# EAGLE design gewaechshaus (EAGLE 9.2.2)
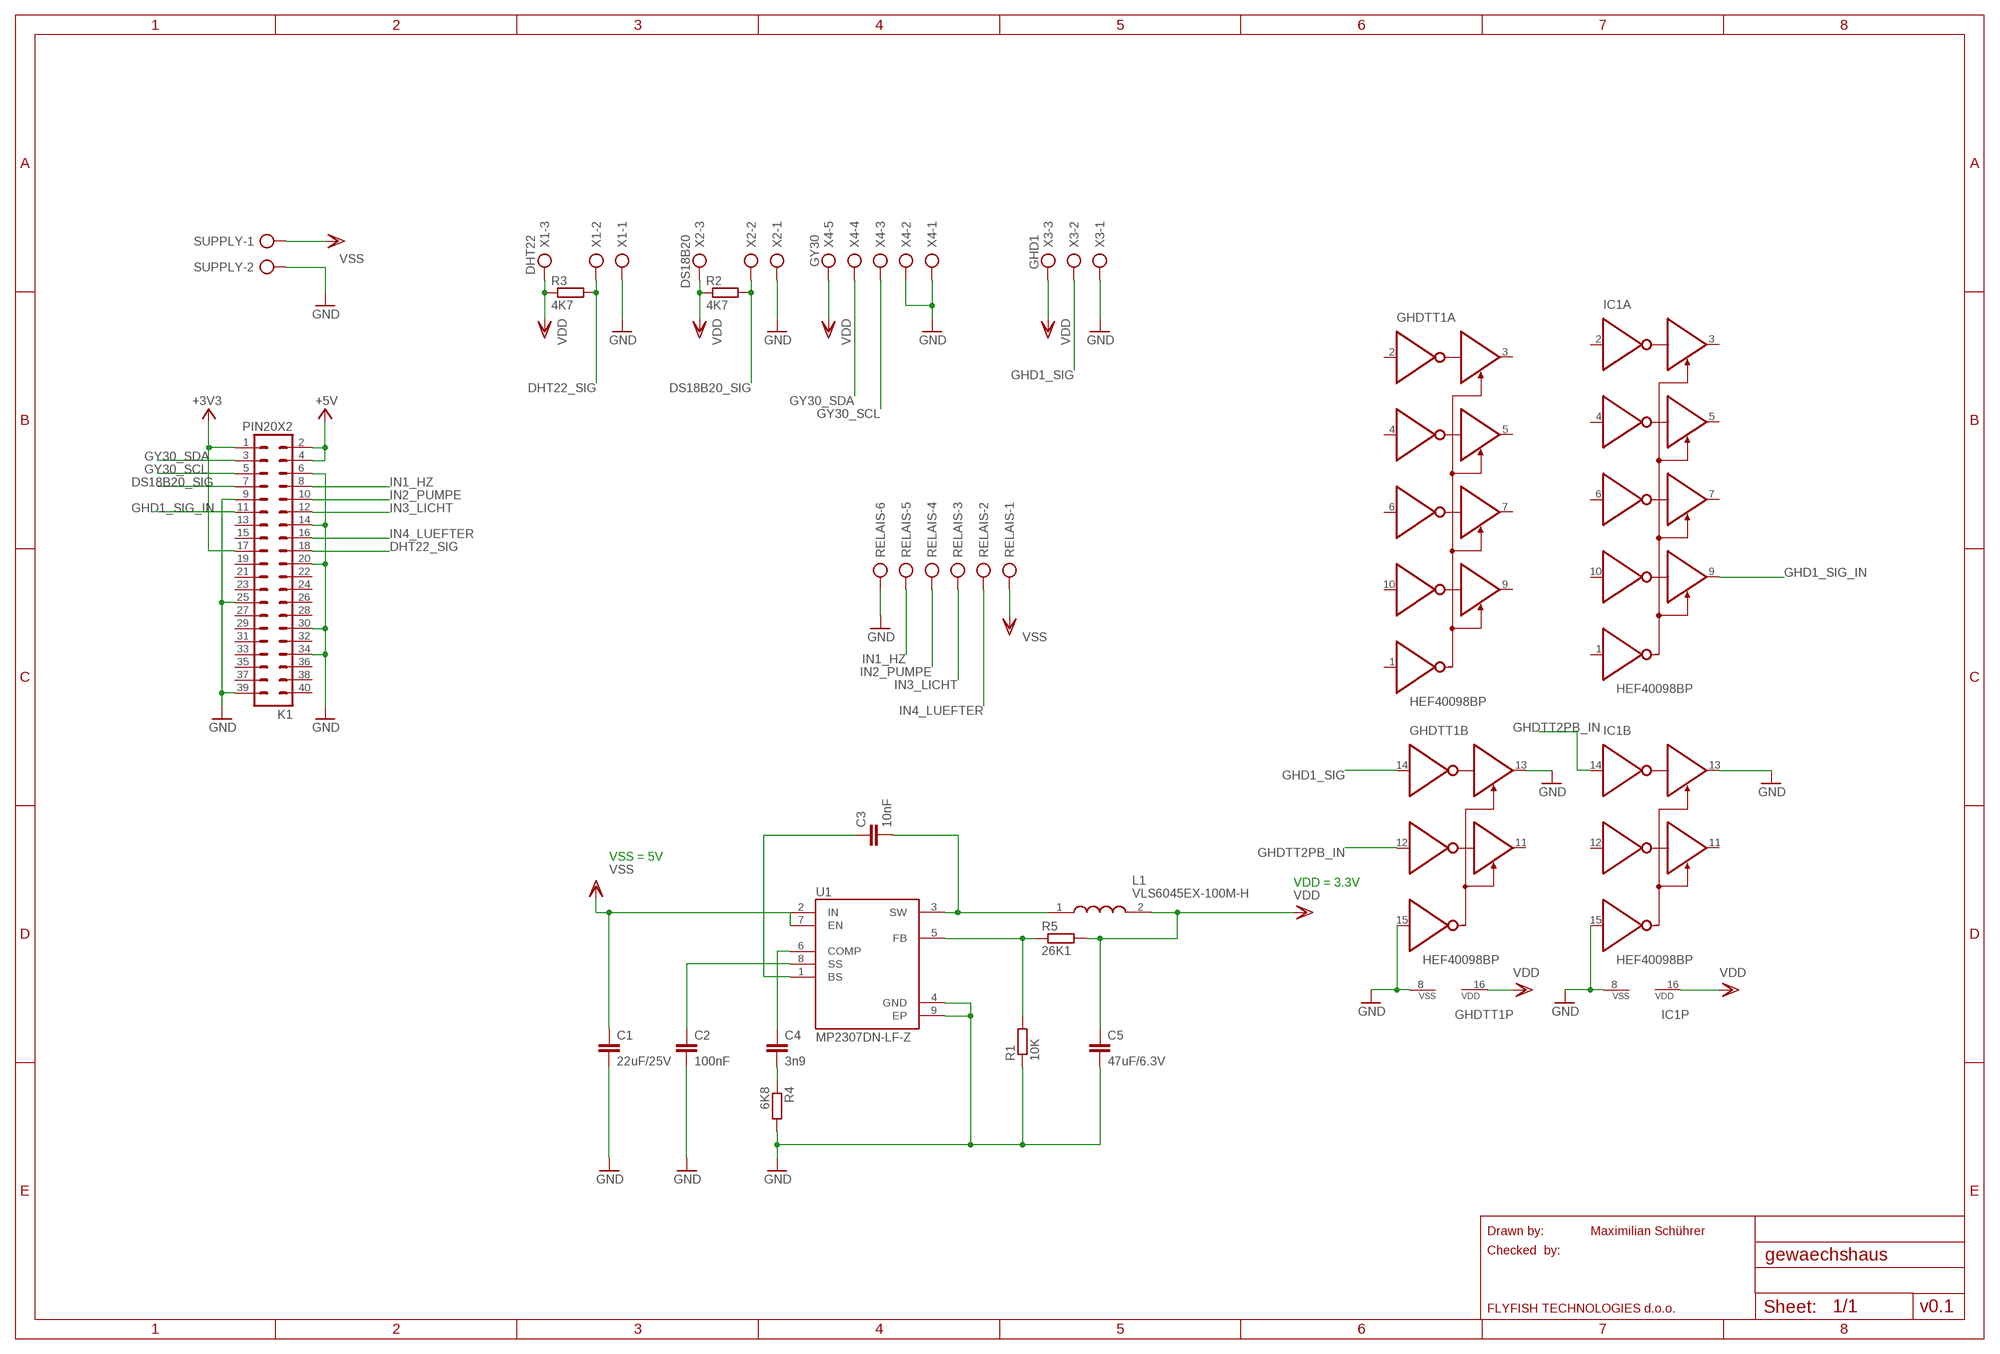
[diagram p0: schematic, sheet 1]

## Parts
C1  22uF/25V  C-EUC0805K  [C0805K]
C2  100nF  C-EUC0805K  [C0805K]
C3  10nF  C-EUC0805K  [C0805K]
C4  3n9  C-EUC0805K  [C0805K]
C5  47uF/6.3V  C-EUC0805K  [C0805K]
GHDTT1  HEF40098BP  [DIL16]
IC1  HEF40098BP  [DIL16]
K1  PIN20X2  [PIN_20X2]
L1  VLS6045EX-100M-H  [INDPM6360X450N]
R1  10K  R-EU_R0805  [R0805]
R2  4K7  R-EU_R0805  [R0805]
R3  4K7  R-EU_R0805  [R0805]
R4  6K8  R-EU_R0805  [R0805]
R5  26K1  R-EU_R0805  [R0805]
RELAIS  AK500/6  [AK500/6]
SUPPLY  AK500/2  [AK500/2]
U1  MP2307DN-LF-Z  [SOIC127P600X170-9N]
X1  DHT22  AK500/3  [AK500/3]
X2  DS18B20  AK500/3  [AK500/3]
X3  GHD1  AK500/3  [AK500/3]
X4  GY30  AK500/5  [AK500/5]

## Nets
+3V3: K1.1 K1.17
+5V: K1.2 K1.4
DHT22_SIG: K1.18 R3.2 X1.2
DS18B20_SIG: K1.7 R2.2 X2.2
GHD1_SIG: GHDTT1.14(B:2A0) X3.2
GHD1_SIG_IN: IC1.9(A:1Y3) K1.11
GHDTT2PB_IN: GHDTT1.12(B:2A1) IC1.14(B:2A0)
GND: C1.2 C2.2 C5.2 GHDTT1.8(P:VSS) GHDTT1.13(B:2Y0) GHDTT1.15(B:2!OE) IC1.8(P:VSS) IC1.13(B:2Y0) IC1.15(B:2!OE) K1.6 K1.9 K1.14 K1.20 K1.25 K1.30 K1.34 K1.39 R1.1 R4.2 RELAIS.6 SUPPLY.2 U1.4(GND) U1.9(EP) X1.1 X2.1 X3.1 X4.1 X4.2
GY30_SCL: K1.5 X4.3
GY30_SDA: K1.3 X4.4
IN1_HZ: K1.8 RELAIS.5
IN2_PUMPE: K1.10 RELAIS.4
IN3_LICHT: K1.12 RELAIS.3
IN4_LUEFTER: K1.16 RELAIS.2
N$1: R1.2 R5.1 U1.5(FB)
N$3: C2.1 U1.8(SS)
N$4: C3.1 U1.1(BS)
N$5: C3.2 L1.1 U1.3(SW)
N$6: C4.1 U1.6(COMP)
N$7: C4.2 R4.1
VDD: C5.1 GHDTT1.16(P:VDD) IC1.16(P:VDD) L1.2 R2.1 R3.1 R5.2 X1.3 X2.3 X3.3 X4.5
VSS: C1.1 RELAIS.1 SUPPLY.1 U1.2(IN) U1.7(EN)
Unconnected: GHDTT1.1(A:1!OE) GHDTT1.2(A:1A0) GHDTT1.3(A:1Y0) GHDTT1.4(A:1A1) GHDTT1.5(A:1Y1) GHDTT1.6(A:1A2) GHDTT1.7(A:1Y2) GHDTT1.9(A:1Y3) GHDTT1.10(A:1A3) GHDTT1.11(B:2Y1) IC1.1(A:1!OE) IC1.2(A:1A0) IC1.3(A:1Y0) IC1.4(A:1A1) IC1.5(A:1Y1) IC1.6(A:1A2) IC1.7(A:1Y2) IC1.10(A:1A3) IC1.11(B:2Y1) IC1.12(B:2A1) K1.13 K1.15 K1.19 K1.21 K1.22 K1.23 K1.24 K1.26 K1.27 K1.28 K1.29 K1.31 K1.32 K1.33 K1.35 K1.36 K1.37 K1.38 K1.40

## Notes on the sheet
- VSS = 5V
- VDD = 3.3V
- Drawn by: | Maximilian Schührer
- Checked  by:
- FLYFISH TECHNOLOGIES d.o.o. | v0.1

## Library data of the parts
C1-C5 = rcl:C-EU: CAPACITOR, European symbol; SPICEPREFIX: C
GHDTT1 IC1 = 40xx:HEF40098B: Hex inverting buffer, 3-state Source: Data sheet <http://www.nxp.com/documents/data_sheet/HEF40098B.pdf>
K1 = FLYFISH:PIN20X2
L1 = VLS6045EX-100M-H:VLS6045EX-100M-H: Inductors for Power Circuits, Automotive, Wound Ferrite material, VLS6045EX-H, -40 to +125 Source: Datasheet <https://componentsearchengine.com/Datasheets/1/VLS6045EX-100M-H.pdf>; DESCRIPTION: Inductors for Power Circuits, Automotive, Wound Ferrite material, VLS6045EX-H, -40 to +125; HEIGHT: 4.5mm; MANUFACTURER_NAME: TDK; MANUFACTURER_PART_NUMBER: VLS6045EX-100M-H; MOUSER_PART_NUMBER: 810-VLS6045EX-100M-H
R1-R5 = rcl:R-EU_: RESISTOR, European symbol; SPICEPREFIX: R
RELAIS = con-ptr500:AK500/6: CONNECTOR; OC_FARNELL: unknown; OC_NEWARK: unknown
SUPPLY = con-ptr500:AK500/2: CONNECTOR; OC_FARNELL: unknown; OC_NEWARK: unknown
U1 = MP2307DN-LF-Z:MP2307DN-LF-Z: MP2307 Series 23 V 3 A 380 KHz Synchronous Rectified Step-Down Converter-SOIC-8; AVAILABILITY: Unavailable; DESCRIPTION: MP2307 Series 23 V 3 A 380 KHz Synchronous Rectified Step-Down Converter-SOIC-8; MF: Monolithic Power; MP: MP2307DN-LF-Z; PACKAGE: SOIC-8 Monolithic Power; PRICE: None
X1-X3 = con-ptr500:AK500/3: CONNECTOR; OC_FARNELL: unknown; OC_NEWARK: unknown
X4 = con-ptr500:AK500/5: CONNECTOR; OC_FARNELL: unknown; OC_NEWARK: unknown

## Board
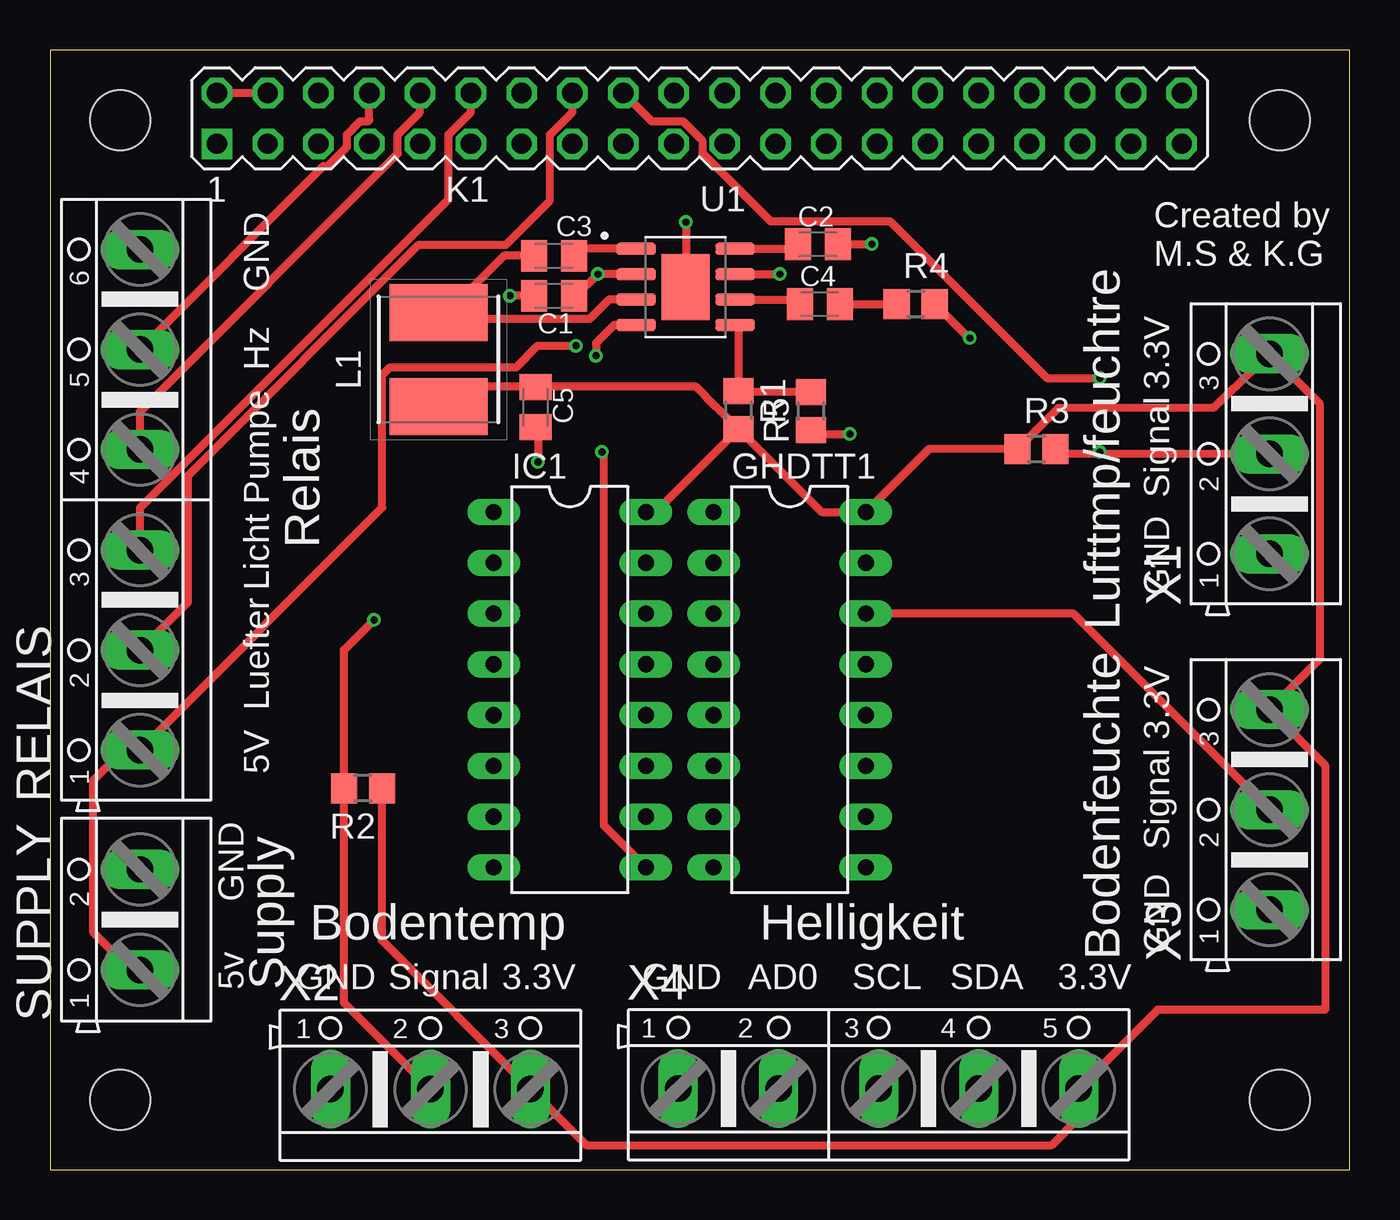
[diagram p1: board, top side]
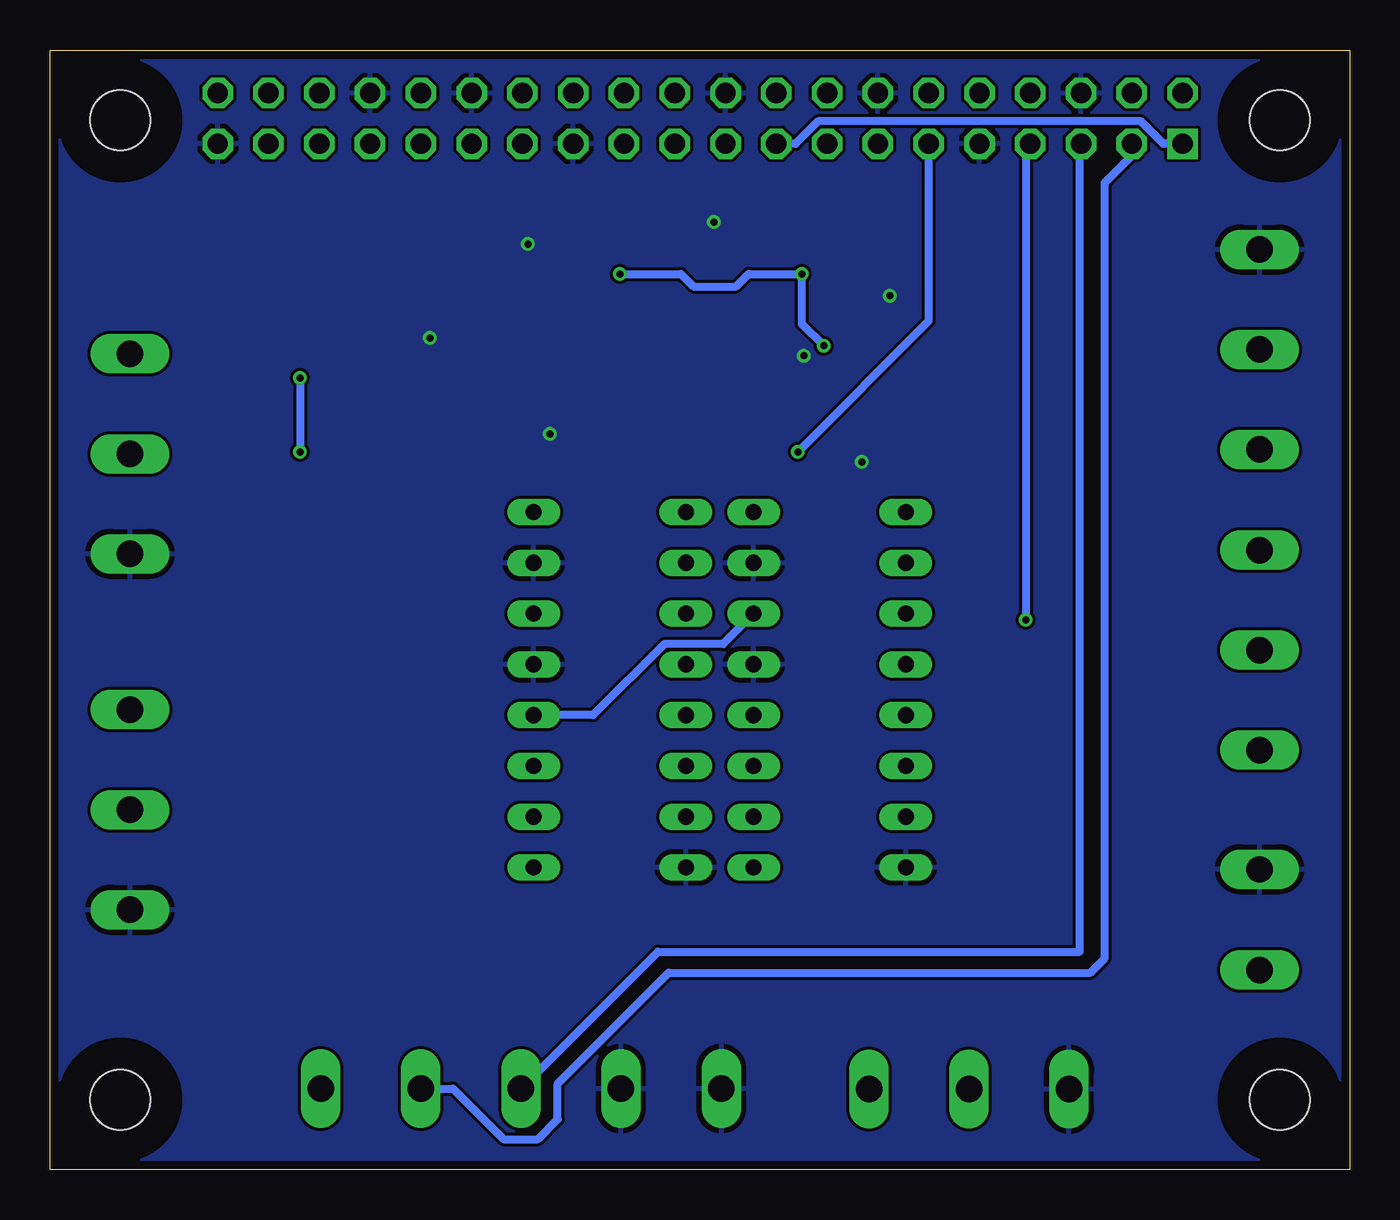
[diagram p2: board, bottom side, seen from below]

Size 65 x 56 mm. Coordinates in mm from the lower left corner, seen from the top.
Outline: 0,0 65,0 65,56 0,56 0,0
Copper layers (1*16): Top 0.035mm / dielectric 1.5mm / Bottom 0.035mm
Design rules "MyRules": minimum track width 6mil, minimum drill 12mil, track to track 6mil, track to pad 6mil, pad to pad 6mil, via to via 6mil, smd to smd 0mil, copper to edge 10mil, drill to drill 10mil, minimum pad ring 10mil, minimum via ring 6mil, stop-mask expansion 2mil, vias tented up to drill 25mil, thermal gap 10mil
Holes 3 mm at 3.5,52.5 61.5,52.5 61.5,3.5 3.5,3.5
tRestrict: area 1.9,51 to 5,54; area 60,51 to 63,54; area 60,1.9 to 63,5; area 1.9,1.9 to 5,5
bRestrict: area 1.9,51 to 5,54; area 60,51 to 63,54; area 60,1.9 to 63,5; area 1.9,1.9 to 5,5

### Footprints (pad centres in the part's own frame; a part is rotated, then mirrored left to right if it is on the bottom)
C0805K = smd 1.3 x 1.6: 1 -1,0; 2 1,0
DIL16 = drill 0.813 long: 1 -8.89,-3.81; 2 -6.35,-3.81; 3 -3.81,-3.81; 4 -1.27,-3.81; 5 1.27,-3.81; 6 3.81,-3.81; 7 6.35,-3.81; 8 8.89,-3.81; 9 8.89,3.81; 10 6.35,3.81; 11 3.81,3.81; 12 1.27,3.81; 13 -1.27,3.81; 14 -3.81,3.81; 15 -6.35,3.81; 16 -8.89,3.81
PIN_20X2 = drill 1.016 square: 1 -24.13,-1.27 | drill 1.016 octagon: 2 -24.13,1.27; 3 -21.59,-1.27; 4 -21.59,1.27; 5 -19.05,-1.27; 6 -19.05,1.27; 7 -16.51,-1.27; 8 -16.51,1.27; 9 -13.97,-1.27; 10 -13.97,1.27; 11 -11.43,-1.27; 12 -11.43,1.27; 13 -8.89,-1.27; 14 -8.89,1.27; 15 -6.35,-1.27; 16 -6.35,1.27; 17 -3.81,-1.27; 18 -3.81,1.27; 19 -1.27,-1.27; 20 -1.27,1.27; 21 1.27,-1.27; 22 1.27,1.27; 23 3.81,-1.27; 24 3.81,1.27; 25 6.35,-1.27; 26 6.35,1.27; 27 8.89,-1.27; 28 8.89,1.27; 29 11.43,-1.27; 30 11.43,1.27; 31 13.97,-1.27; 32 13.97,1.27; 33 16.51,-1.27; 34 16.51,1.27; 35 19.05,-1.27; 36 19.05,1.27; 37 21.59,-1.27; 38 21.59,1.27; 39 24.13,-1.27; 40 24.13,1.27
INDPM6360X450N = smd 2.85 x 4.9: 1 -2.35,0; 2 2.35,0
R0805 = smd 1.3 x 1.5: 1 -0.95,0; 2 0.95,0
AK500/6 = drill 1.321 long: 1 -12.522,0; 2 -7.518,0; 3 -2.515,0; 4 2.515,0; 5 7.518,0; 6 12.522,0
AK500/2 = drill 1.321 long: 1 -2.515,0; 2 2.515,0
SOIC127P600X170-9N = smd 1.97 x 0.6: 1 -2.475,1.905; 2 -2.475,0.635; 3 -2.475,-0.635; 4 -2.475,-1.905; 5 2.475,-1.905; 6 2.475,-0.635; 7 2.475,0.635; 8 2.475,1.905 | smd 2.41 x 3.3: 9 0,0
AK500/3 = drill 1.321 long: 1 -5.004,0; 2 0,0; 3 5.004,0
AK500/5 = drill 1.321 long: 1 -10.033,0; 2 -5.004,0; 3 0,0; 4 5.004,0; 5 10.008,0

### Placement (x,y rotation side)
C1  25.2,43.7 180 top
C2  38.4,46.28 0 top
C3  25.2,45.7 180 top
C4  38.5,43.3 0 top
C5  24.28,38.13 270 top
GHDTT1  37,24 270 top
IC1  26,24 270 top
K1  32.48,52.58 0 top
L1  19.43,40.52 270 top
R1  38.07,37.93 90 top
R2  15.65,19.07 180 top
R3  49.34,36.05 0 top
R4  43.3,43.3 0 top
R5  34.43,37.99 270 top
RELAIS  4.5,33.5 90 top
SUPPLY  4.5,12.5 90 top
U1  31.79,44.15 0 top
X1  61,35.8 90 top
X2  19.03,4.02 0 top
X3  61,18 90 top
X4  41.45,4.05 0 top

### Tracks (layer width: path | path; a pad name or v marks a point on that pad's centre or on a via)
+3V3
  Bottom 0.406: K1.1 9.31,51.31 10.43,52.43 26.59,52.43 27.71,51.31 K1.17
+5V
  Top 0.406: K1.2 K1.4
DHT22_SIG  (via drill 0.35)
  Top 0.406: X1.2 52.6,35.8 v52.5,35.9 52.4,35.8 50.54,35.8 R3.2 | K1.18 30.09,52.43 31.67,52.43 32.63,51.47 32.63,50.85 36.04,47.44 42.02,47.44 49.85,39.6 v52.5,39.6
  Bottom 0.406: v52.5,39.6 v52.5,35.9
DS18B20_SIG  (via drill 0.35)
  Top 0.406: X2.2 14.7,8.35 R2.2 | R2.2 14.7,19.37 | R2.2 14.7,26 v16.2,27.5
  Bottom 0.406: K1.7 16.2,51.08 v16.2,27.5
GHD1_SIG
  Top 0.406: X3.2 51.19,27.81 GHDTT1.14
GHD1_SIG_IN  (via drill 0.35)
  Top 0.406: IC1.9 27.71,17.21 27.71,35.79 v27.6,35.9
  Bottom 0.406: v27.6,35.9 21.05,42.45 K1.11
GHDTT2PB_IN
  Bottom 0.406: IC1.14 31.33,26.29 34.27,26.29 37.83,22.73 GHDTT1.12
GND  (via drill 0.35)
  Top 0.406: C2.2 41.08,46.28 v41.1,46.3 | R4.2 45.95,41.6 v46,41.6 | C5.2 24.4,37.01 v24.4,35.4 | R1.1 38.25,36.8 v40,36.8 | C1.2 v23,43.7 | U1.4 28.21,42.24 27.3,41.33 v27.3,40.7 | v31.8,47.4 U1.9
  pour Bottom: 0.5,55.5 0.5,0.5 64.5,0.5 64.5,55.5
GY30_SCL
  Bottom 0.406: X4.3 34.6,10.9 13.5,10.9 13.5,51.24 K1.5
GY30_SDA
  Bottom 0.406: X4.4 44.84,4.05 42.31,1.51 40.59,1.51 39.6,2.5 39.6,4.3 34.06,9.84 12.97,9.84 12.24,10.57 12.24,49.36 10.89,50.71 K1.3
IN1_HZ
  Top 0.406: K1.8 15.97,52.49 15.91,52.43 15.51,52.43 14.85,51.77 14.85,51.15 13.89,50.19 13.67,50.19 RELAIS.5
IN2_PUMPE
  Top 0.406: RELAIS.4 4.5,37.91 17.41,50.83 17.39,50.85 17.39,51.77 18.51,52.89 K1.10
IN3_LICHT
  Top 0.406: RELAIS.3 4.5,33.11 19.93,48.54 19.93,51.77 21.05,52.89 K1.12
IN4_LUEFTER
  Top 0.406: K1.16 26.13,52.89 25.01,51.77 25.01,48.47 22.81,46.26 18.44,46.26 6.9,34.72 6.9,28.38 RELAIS.2
N$1
  Top 0.406: U1.5 34.43,42.08 R5.1 34.49,38.88 R1.2
N$3
  Top 0.406: U1.8 37.17,46.05 C2.1
N$4
  Top 0.406: U1.1 26.55,46.05 C3.1
N$5
  Top 0.406: L1.1 20,43.44 20.22,43.22 | U1.3 27.97,43.52 27,42.54 20.9,42.54 20.22,43.22 | C3.2 22.7,45.7 20.22,43.22
N$6
  Top 0.406: U1.6 34.28,43.5 37.3,43.5 C4.1
N$7
  Top 0.406: C4.2 R4.1
VDD
  Top 0.406: L1.2 20.43,39.17 24.24,39.17 C5.1 24.3,39.16 32.31,39.16 33.32,38.15 33.32,38.14 33.53,37.93 33.54,37.93 R5.2 | R5.2 30.28,32.89 IC1.16 | R5.2 38.58,32.89 GHDTT1.16 43.97,36.05 R3.1 49.28,36.94 49.28,36.95 50.44,38.1 58.19,38.1 X1.3 63.5,38.31 63.5,25.54 X3.3 63.78,20.22 63.78,8 55.41,8 X4.5 51.46,2.58 50.1,1.22 26.84,1.22 X2.3 16.6,11.45 R2.1
VSS  (via drill 0.35)
  Top 0.406: SUPPLY.1 4.04,9.98 2.16,11.86 2.16,19.47 3.67,20.98 RELAIS.1 16.62,33.1 16.62,39.74 17.02,40.14 23.33,40.14 24.4,41.2 v26.3,41.2 | C1.1 26.3,43.7 v27.4,44.8 29.3,44.8 U1.2 | U1.7 36.48,44.78 v36.5,44.8
  Bottom 0.406: v26.3,41.2 27.4,42.3 v27.4,44.8 30.06,44.8 30.7,44.17 32.8,44.17 33.44,44.8 v36.5,44.8

### Text on the board
tNamesBetter: GND | Created by / M.S & K.G | Hz | Pumpe | 3.3V | Relais | Signal | Licht | Luefter | GND | Lufttmp/feuchtre | 5V | 3.3V | Signal | GND | Bodentemp | Helligkeit | GND | Bodenfeuchte | 5v | Supply | GND | Signal | 3.3V | GND | AD0 | SCL | SDA | 3.3V